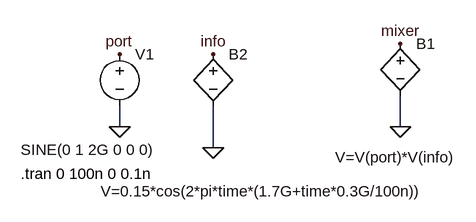
[diagram p0: schematic Mixer.asc]
Mixer.asc, the LTspice schematic file:
Version 4
SHEET 1 880 680
WIRE 32 176 32 144
WIRE 464 176 464 128
WIRE 176 208 176 144
FLAG 32 176 0
FLAG 176 208 0
FLAG 32 64 port
FLAG 176 64 info
FLAG 464 176 0
FLAG 464 48 mixer
SYMBOL voltage 32 48 R0
WINDOW 3 -152 163 Left 2
WINDOW 123 0 0 Left 2
WINDOW 39 0 0 Left 2
SYMATTR Value SINE(0 1 2G 0 0 0)
SYMATTR InstName V1
SYMBOL bv 464 32 R0
WINDOW 3 -100 191 Left 2
SYMATTR Value V=V(port)*V(info)
SYMATTR InstName B1
SYMBOL bv 176 48 R0
WINDOW 3 -173 227 Left 2
SYMATTR Value V=0.15*cos(2*pi*time*(1.7G+time*0.3G/100n))
SYMATTR InstName B2
TEXT -120 248 Left 2 !.tran 0 100n 0 0.1n

The netlist it stands for:
* Mixer.asc
V1 port 0 SINE(0 1 2G 0 0 0)
B1 mixer 0 V=V(port)*V(info)
B2 info 0 V=0.15*cos(2*pi*time*(1.7G+time*0.3G/100n))
.tran 0 100n 0 0.1n
.backanno
.end

* Results of the author's LTspice run, read from the files saved beside the schematic
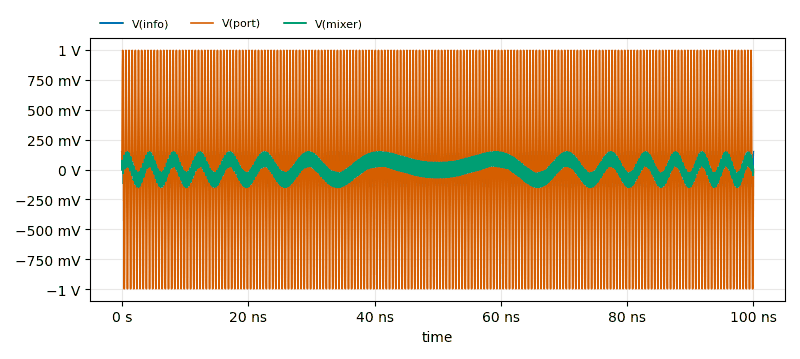
[diagram p1: Transient Analysis of Mixer.asc, plotted from the saved traces]
* Transient Analysis, 1 run:
*   V(info): min -149.7 mV, max 150 mV, average 8.427 µV, rms 101.7 mV, last 150 mV
*   V(port): min -996.8 mV, max 996.8 mV, average 2.673 µV, rms 705.8 mV, last 0 V
*   V(mixer): min -149.2 mV, max 149.1 mV, average 8.325 mV, rms 72.84 mV, last 0 V